# Altium project ecube.PrjPCB
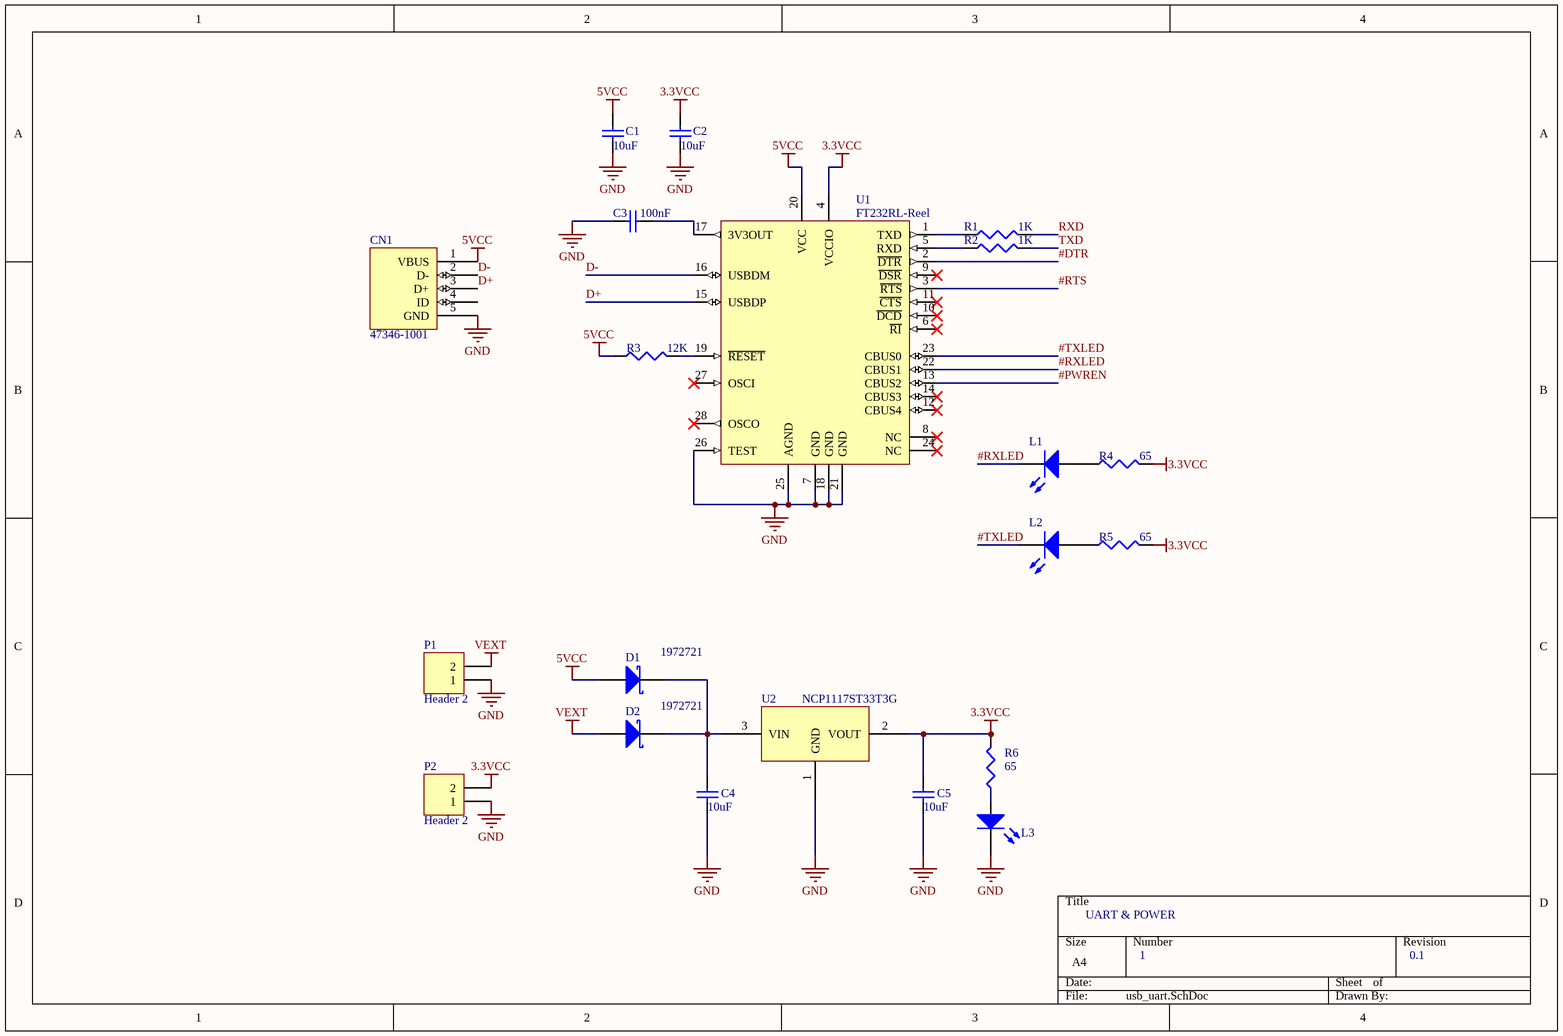
[diagram p0: usb_uart.SchDoc]
3 sheets, 56 parts. Net scope: global (net labels, ports and power ports of the same name join across sheets).
Board file: PCB1.PcbDoc
Sheets:
  usb_uart.SchDoc
  processingsys.SchDoc
  mpu6050.SchDoc

## Sheet usb_uart.SchDoc
size A4

### Parts
C1  value 10uF  [C1206]  (hidden comment: Cap Semi)
C2  value 10uF  [C1206]  (hidden comment: Cap Semi)
C3  value 100nF  [C1206]  (hidden comment: Cap Semi)
C4  value 10uF  [C1206]  (hidden comment: Cap Semi)
C5  value 10uF  [C1206]  (hidden comment: Cap Semi)
CN1  47346-1001  [47346-1001]
D1  Supplier Part Number 1: 1972721  [SOD-128]  (hidden comment: PMEG3020DEP,115)
D2  Supplier Part Number 1: 1972721  [SOD-128]  (hidden comment: PMEG3020DEP,115)
L1  KM-23  [SOT-23]  (value not drawn)
L2  KM-23  [SOT-23]  (value not drawn)
L3  KM-23  [SOT-23]  (value not drawn)
P1  Header 2  [HDR1X2]
P2  Header 2  [HDR1X2]
R1  value 1K  [J1-0603]  (hidden comment: Res3)
R2  value 1K  [J1-0603]  (hidden comment: Res3)
R3  value 12K  [J1-0603]  (hidden comment: Res3)
R4  value 65  [J1-0603]  (hidden comment: Res3)
R5  value 65  [J1-0603]  (hidden comment: Res3)
R6  value 65  [J1-0603]  (hidden comment: Res3)
U1  FT232RL-Reel  [SSOP-28_N]
U2  NCP1117ST33T3G  [SOT-223-3]

### Nets
3.3VCC: C2.2 C5.1 P2.2 R4.2 R5.2 R6.2 U1.4(VCCIO) U2.2(VOUT)
5VCC: C1.2 CN1.1(VBUS) D1.2(A) R3.1 U1.20(VCC)
GND: C1.1 C2.1 C3.1 C4.1 C5.2 CN1.5(GND) L3.3(K) P1.1 P2.1 U1.7(GND) U1.18(GND) U1.21(GND) U1.25(AGND) U1.26(TEST) U2.1(GND)
VEXT: D2.2(A) P1.2
#DTR: U1.2(~{DTR})
#PWREN: U1.13(CBUS2)
#RTS: U1.3(~{RTS})
#RXLED: L1.3(K) U1.22(CBUS1)
#TXLED: L2.3(K) U1.23(CBUS0)
D+: CN1.3(D+) U1.15(USBDP)
D-: CN1.2(D-) U1.16(USBDM)
RXD: R1.2
TXD: R2.2
NetC3_2: C3.2 U1.17(3V3OUT)
NetC4_2: C4.2 D1.1(K) D2.1(K) U2.3(VIN)
NetL1_1: L1.1(A) R4.1
NetL2_1: L2.1(A) R5.1
NetL3_1: L3.1(A) R6.1
NetR1_1: R1.1 U1.1(TXD)
NetR2_1: R2.1 U1.5(RXD)
NetR3_2: R3.2 U1.19(~{RESET})

Not connected (* = marked no-connect by the designer): CN1 4(ID); U1 6(~{RI})* 8(NC)* 9(~{DSR})* 10(~{DCD})* 11(~{CTS})* 12(CBUS4)* 14(CBUS3)* 24(NC)* 27(OSCI)* 28(OSCO)*

### Notes on the sheet
- UART & POWER
- 1
- 0.1

### Library data of the parts
C1-C5 = Cap Semi: Capacitor (Semiconductor SIM Model); Published: 8-Jun-2000; LatestRevisionDate: 29-May-2009; LatestRevisionNote: IPC-7351 Footprint Added.; PackageReference: C1206; Publisher: Altium Limited; PackageDescription: Chip Capacitor
CN1 = 47346-1001: MOLEX - 47346-1001 - MULTIPOLE CONNECTOR Conector USB, Micro USB Tipo B, USB 2.0 Montaje Superficial,; Number of Circuits: 5; Pitch: 0.65mm; ComponentLink1Description: Farnell; ComponentLink1URL: https://es.farnell.com/molex/47346-1001/conector-micro-usb-tipo-b-hembra/dp/2782045?st=Conector%20USB,%20Micro%20USB%20Tipo%20B; Supplier 1: Farnell; Manufacturer: Molex; Manufacturer Part Number: 47346-1001; Stock 1: 336; Pricing 1: 1=0.624, 60=0.6, 200=0.556, 500=0.532, 1000=0.503 (EUR); Mount: Surface Mount; Contact Material: Copper Alloy; Contact Plating: Gold; Housing Material: Polymer; Min Operating Temperature: -30°C; Max Operating Temperature: 85°C; Orientation: Right Angle; Termination: Solder; Length: 7.8mm; REACH SVHC: No SVHC; Halogen Free: Low Halogen
D1 D2 = PMEG3020DEP,115: NEXPERIA - Rectificador Schottky, 30 V, 2 A; Manufacturer: NXP Semiconductors; Forward Current: 2A; Max Repetitive Reverse Voltage (Vrrm): 30V; Element Configuration: Single; Forward Voltage: 520mV; Peak Reverse Current: 50uA; Peak Non-Repetitive Surge Current: 50A; Max Power Dissipation: 625mW; ComponentLink1Description: farnell; ComponentLink1URL: https://es.farnell.com/nexperia/pmeg3020dep-115/diodo-schott-rect-30v-2a-sod128/dp/1972721?st=PMEG3020DEP,115; Supplier 1: Farnell; Manufacturer Part Number: PMEG3020DEP,115; Stock 1: 4; Pricing 1: 5=0.351, 25=0.27, 100=0.189, 250=0.167, 500=0.145, 1000=0.123, 5000=0.106 (EUR); Mount: Surface Mount; Number of Pins: 2; Min Operating Temperature: -55°C; Max Operating Temperature: 150°C; Packaging: Tape and Reel; Max Surge Current: 50A; Package Quantity: 3000; Max Reverse Leakage Current: 50uA; Average Rectified Current: 2A; Max Reverse Voltage (DC): 30V; Radiation Hardening: No; Lead Free: Lead Free; ComponentLink2URL: http://www.nxp.com/documents/data_sheet/PMEG3020DEP.pdf?ecmp=mouser; ComponentLink2Description: http://www.nxp.com/documents/data_sheet/PMEG3020DEP.pdf?ecmp=mouser; ComponentLink3URL: http://www.nxp.com/documents/data_sheet/PMEG3020DEP.pdf; ComponentLink3Description: http://www.nxp.com/documents/data_sheet/PMEG3020DEP.pdf
L1-L3 = KM-23: Kingbright - LED, SOT-23; Manufacturer Part Number: KM-23ID-F; Colour: Red; Lens Colour: Clear; Viewing Angle: 140°; Forward Voltage: 2V; Lens Style: Colored,Diffused,Rectangular; Luminous Intensity: 12mcd; Wavelength: 625nm; Forward Current: 20mA; Number of LEDs: 1; ComponentLink1Description: farnell -RED; ComponentLink1URL: https://es.farnell.com/kingbright/km-23id-f/led-red-sot-23-smd/dp/2099216?st=KM-23ID; ComponentLink2Description: farnell-Green; ComponentLink2URL: https://es.farnell.com/kingbright/km-23sgd-f/led-green-sot-23-smd/dp/2099217?st=KM-23; Supplier 1: Farnell; Manufacturer: Kingbright; Stock 1: 10839; Pricing 1: 5=0.118, 25=0.112, 100=0.106, 250=0.101, 500=0.0968, 1000=0.0928 (GBP); Mount: Surface Mount; Case/Package: SOT-23; Number of Pins: 3; Dominant Wavelength: 625nm; Length: 2.8mm; Height: 1mm; Width: 1.2mm; Radiation Hardening: No; REACH SVHC: No SVHC; ComponentLink3URL: http://www.farnell.com/datasheets/1563685.pdf; ComponentLink3Description: http://www.farnell.com/datasheets/1563685.pdf; ComponentLink4URL: https://www.distrelec.biz/Web/Downloads/d_/en/cuKingbright_SOT-23_SMT-LED_EN.pdf?mime=application%2Fpdf; ComponentLink4Description: https://www.distrelec.biz/Web/Downloads/d_/en/cuKingbright_SOT-23_SMT-LED_EN.pdf?mime=application%2Fpdf; ComponentLink5URL: http://uk.rs-online.com/webdocs/032f/0900766b8032f166.pdf; ComponentLink5Description: http://uk.rs-online.com/webdocs/032f/0900766b8032f166.pdf; ComponentLink6URL: http://www.produktinfo.conrad.com/datenblaetter/175000-199999/180090-da-01-en-LED_SOT23_TYP_KM_23ID_F.pdf; ComponentLink6Description: http://www.produktinfo.conrad.com/datenblaetter/175000-199999/180090-da-01-en-LED_SOT23_TYP_KM_23ID_F.pdf; ComponentLink7URL: http://www.produktinfo.conrad.com/datenblaetter/125000-149999/144223-da-01-en-SMD_Leuchtdioden_KM23ID_Sot23_rot.pdf; ComponentLink7Description: http://www.produktinfo.conrad.com/datenblaetter/125000-149999/144223-da-01-en-SMD_Leuchtdioden_KM23ID_Sot23_rot.pdf
P1 P2 = Header 2: Header, 2-Pin; LatestRevisionDate: 17-Jul-2002; LatestRevisionNote: Re-released for DXP Platform.; Publisher: Altium Limited
R1-R6 = Res3: Resistor; Published: 8-Jun-2000; LatestRevisionDate: 29-May-2009; LatestRevisionNote: IPC-7351 Footprint Added.; PackageReference: J1-0603; Publisher: Altium Limited; PackageDescription: Chip Resistor
U1 = FT232RL-Reel: USB UART Asynchronous Serial Data Transfer Chip, SSOP-28, Tape and Reel; Published: 19-Aug-2010; DatasheetVersion: ver 2.07, Jul-2010; PackageVersion: 2010; PackageReference: SSOP-28; Publisher: Altium Limited; PackageDescription: 28-Pin Small Outline Package 0.65 mm Pitch; ComponentLink1Description: Manufacturer Link; ComponentLink1URL: http://www.ftdichip.com/Products/ICs/FT232R.htm; ComponentLink2Description: Datasheet; ComponentLink2URL: http://www.ftdichip.com/Support/Documents/DataSheets/ICs/DS_FT232R.pdf
U2 = NCP1117ST33T3G: ON SEMICONDUCTOR  - Regulador de Tensión Fija LDO 3.3V 1A; Max Input Voltage: 20V; Number of Outputs: 1; Dropout Voltage: 1.07V; Max Supply Voltage: 15V; Min Supply Voltage: 4.75V; Min Input Voltage: 3.5V; Input Bias Current: 6mA; Quiescent Current: 10mA; Polarity: Positive; Reference Voltage: 1.25V; Accuracy: 1%; Output Type: Fixed; ComponentLink1Description: farnell; ComponentLink1URL: https://es.farnell.com/on-semiconductor/ncp1117st33t3g/ic-linear-voltage-regulator/dp/1652366?st=NCP1117ST33T3G; Supplier 1: Farnell; Manufacturer: ON Semiconductor; Manufacturer Part Number: NCP1117ST33T3G; Stock 1: 0; Pricing 1: 150=0.196, 250=0.174, 500=0.151, 1000=0.129, 5000=0.121, 10000=0.116 (EUR); Mount: Surface Mount; Case/Package: SOT-223; Number of Pins: 3; Contact Plating: Matte,Tin; Min Operating Temperature: 0°C; Max Operating Temperature: 125°C; Output Voltage: 3.3V; Packaging: Tape and Reel; Output Current: 1A; Max Output Current: 1A; Package Quantity: 1; Nominal Output Voltage: 3.3V; Number of Regulators: 1; Min Current Limit: 1A; Min Output Voltage: 3.3V; Max Output Voltage: 3.3V; Termination: SMD/SMT; Output Voltage Accuracy: 1%; Length: 6.7mm; Height: 1.69mm; Width: 3.7mm; Radiation Hardening: No; REACH SVHC: No SVHC; Lead Free: Lead Free; Halogen Free: Halogen Free; ComponentLink2URL: http://www.onsemi.ru.com/pub/Collateral/NCP1117-D.PDF; ComponentLink2Description: http://www.onsemi.ru.com/pub/Collateral/NCP1117-D.PDF; ComponentLink3URL: http://www.farnell.com/datasheets/1726422.pdf; ComponentLink3Description: http://www.farnell.com/datasheets/1726422.pdf; ComponentLink4URL: http://www.onsemi.com/pub/Collateral/NCP1117-D.PDF; ComponentLink4Description: http://www.onsemi.com/pub/Collateral/NCP1117-D.PDF; ComponentLink5URL: https://www.verical.com/server-webapp/html/getDatasheet?partID=82718; ComponentLink5Description: https://www.verical.com/server-webapp/html/getDatasheet?partID=82718; ComponentLink6URL: http://www.farnell.com/datasheets/1748260.pdf; ComponentLink6Description: http://www.farnell.com/datasheets/1748260.pdf; ComponentLink7URL: http://www.onsemi.com/pub_link/Collateral/NCP1117-D.PDF; ComponentLink7Description: http://www.onsemi.com/pub_link/Collateral/NCP1117-D.PDF

## Sheet processingsys.SchDoc
size A4
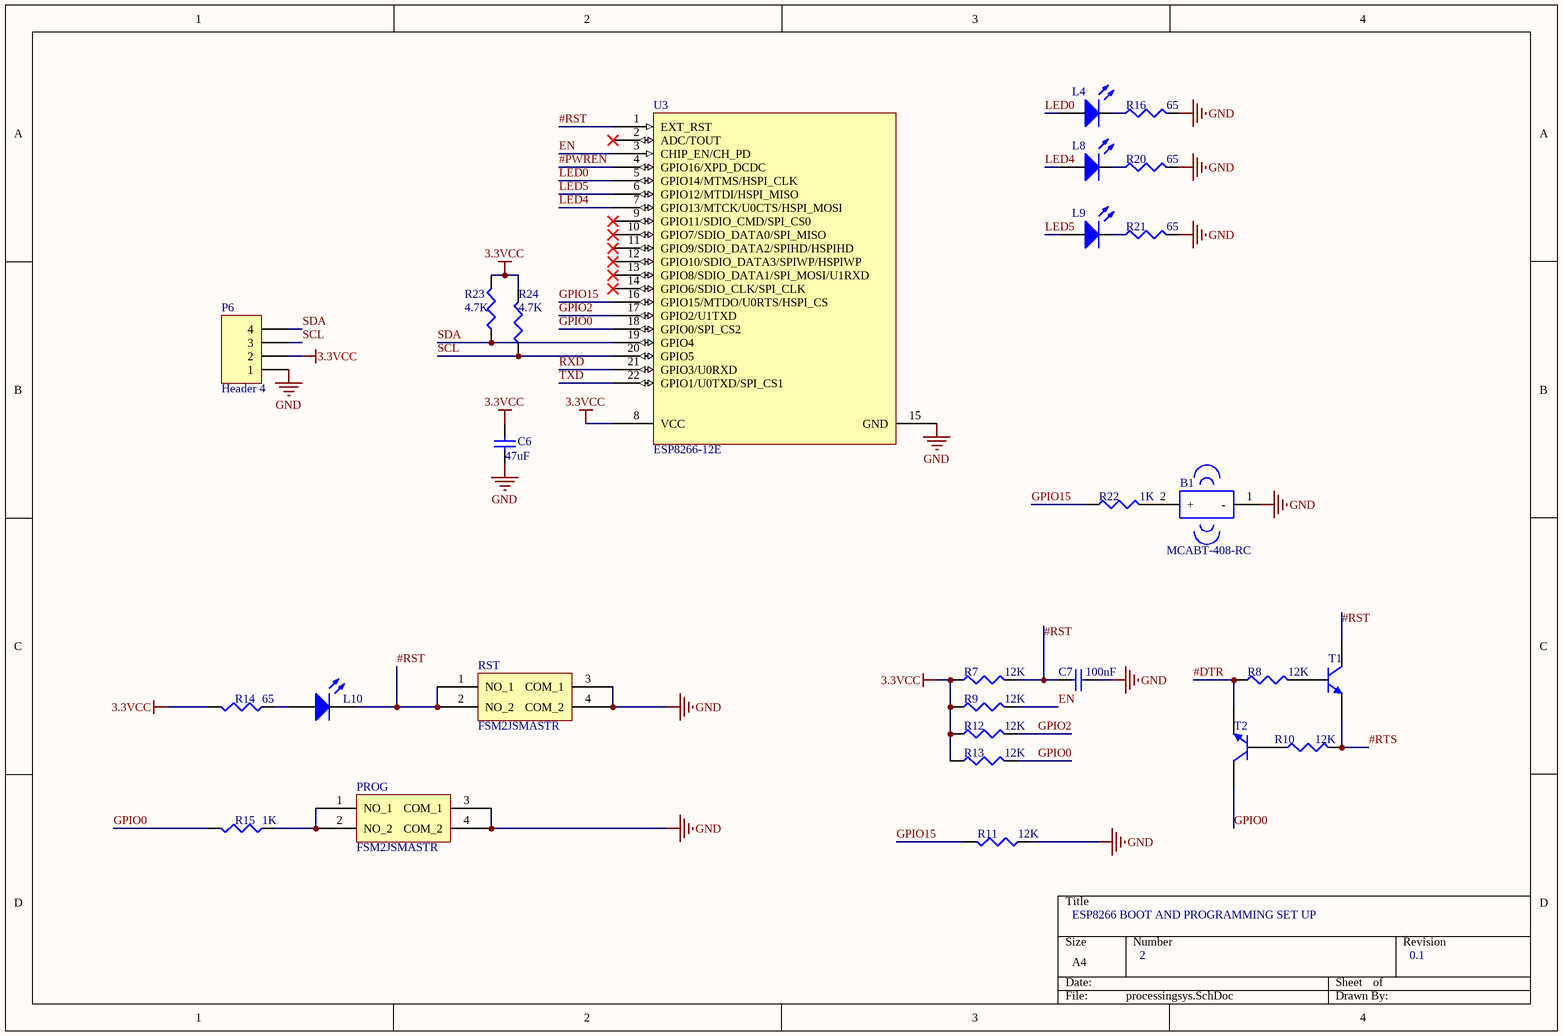
[diagram p1: processingsys.SchDoc]

### Parts
B1  MCABT-408-RC  [MCABT-408-RC]
C6  value 47uF  [C1206]  (hidden comment: Cap Semi)
C7  value 100nF  [C1206]  (hidden comment: Cap Semi)
L4  KM-23  [SOT-23]  (value not drawn)
L8  KM-23  [SOT-23]  (value not drawn)
L9  KM-23  [SOT-23]  (value not drawn)
L10  KM-23  [SOT-23]  (value not drawn)
P6  Header 4  [HDR1X4]
PROG  FSM2JSMASTR  [BUTTON_SMD]
R7  value 12K  [J1-0603]  (hidden comment: Res3)
R8  value 12K  [J1-0603]  (hidden comment: Res3)
R9  value 12K  [J1-0603]  (hidden comment: Res3)
R10  value 12K  [J1-0603]  (hidden comment: Res3)
R11  value 12K  [J1-0603]  (hidden comment: Res3)
R12  value 12K  [J1-0603]  (hidden comment: Res3)
R13  value 12K  [J1-0603]  (hidden comment: Res3)
R14  value 65  [J1-0603]  (hidden comment: Res3)
R15  value 1K  [J1-0603]  (hidden comment: Res3)
R16  value 65  [J1-0603]  (hidden comment: Res3)
R20  value 65  [J1-0603]  (hidden comment: Res3)
R21  value 65  [J1-0603]  (hidden comment: Res3)
R22  value 1K  [J1-0603]  (hidden comment: Res3)
R23  value 4.7K  [J1-0603]  (hidden comment: Res3)
R24  value 4.7K  [J1-0603]  (hidden comment: Res3)
RST  FSM2JSMASTR  [BUTTON_SMD]
T1  SBC846BWT1G  [SOT-323]  (value not drawn)
T2  SBC846BWT1G  [SOT-323]  (value not drawn)
U3  ESP8266-12E  [ESP8266-12E]

### Nets
3.3VCC: C6.2 P6.2 R7.1 R9.1 R12.1 R13.1 R14.2 R23.2 R24.2 U3.8(VCC)
GND: B1.1(-) C6.1 C7.1 P6.1 PROG.3(COM_1) PROG.4(COM_2) R11.1 R16.2 R20.2 R21.2 RST.3(COM_1) RST.4(COM_2) U3.15(GND)
#DTR: R8.1 T2.2(E)
#PWREN: U3.4(GPIO16/XPD_DCDC)
#RST: C7.2 L10.3(K) R7.2 RST.1(NO_1) RST.2(NO_2) T1.3(C) U3.1(EXT_RST)
#RTS: R10.2 T1.2(E)
EN: R9.2 U3.3(CHIP_EN/CH_PD)
GPIO0: R13.2 R15.2 T2.3(C) U3.18(GPIO0/SPI_CS2)
GPIO2: R12.2 U3.17(GPIO2/U1TXD)
GPIO15: R11.2 R22.1 U3.16(GPIO15/MTDO/U0RTS/HSPI_CS)
LED0: L4.1(A) U3.5(GPIO14/MTMS/HSPI_CLK)
LED4: L8.1(A) U3.7(GPIO13/MTCK/U0CTS/HSPI_MOSI)
LED5: L9.1(A) U3.6(GPIO12/MTDI/HSPI_MISO)
RXD: U3.21(GPIO3/U0RXD)
SCL: P6.3 R24.1 U3.20(GPIO5)
SDA: P6.4 R23.1 U3.19(GPIO4)
TXD: U3.22(GPIO1/U0TXD/SPI_CS1)
NetB1_2: B1.2(+) R22.2
NetL4_3: L4.3(K) R16.1
NetL8_3: L8.3(K) R20.1
NetL9_3: L9.3(K) R21.1
NetL10_1: L10.1(A) R14.1
NetPROG_1: PROG.1(NO_1) PROG.2(NO_2) R15.1
NetR8_2: R8.2 T1.1(B)
NetR10_1: R10.1 T2.1(B)

Not connected (* = marked no-connect by the designer): U3 2(ADC/TOUT)* 9(GPIO11/SDIO_CMD/SPI_CS0)* 10(GPIO7/SDIO_DATA0/SPI_MISO)* 11(GPIO9/SDIO_DATA2/SPIHD/HSPIHD)* 12(GPIO10/SDIO_DATA3/SPIWP/HSPIWP)* 13(GPIO8/SDIO_DATA1/SPI_MOSI/U1RXD)* 14(GPIO6/SDIO_CLK/SPI_CLK)*

### Notes on the sheet
- ESP8266 BOOT AND PROGRAMMING SET UP
- 2
- 0.1

### Library data of the parts
B1 = MCABT-408-RC: ransductor, 1 V a 3 V, 85 dBA, Sirena, 70 mA; Manufacturer: Multicomp; Current Rating: 70mA; Self Resonant Frequency: 2.731kHz; Min Supply Voltage: 1V; Max Supply Voltage: 3V; Outside Diameter: 12mm; ComponentLink1Description: farnell; ComponentLink1URL: https://es.farnell.com/multicomp/mcabt-408-rc/ac-stico-electro-mech-audio-1/dp/2361105?krypto=Kzr7701dNdWkobLwazw2WAHmNHziskZrQMg7S%2Faf%2BaL%2F%2Bj%2FkWh1M3S1k%2FYSHSKSx0MzERa16wH8IxUPYeDKx2PmCEW9b7Qq2dWm4YJR83SHnond9nZgPFyrqEJusaoJIK60fC%2FoQdI36P39N2BQPzNsuueVDbqXwGAOKtHeDF30EVb%2FMeWA5wOoM2bNdaZFSgNjAKDp4mZigEnbiecpx7MGL6JOzzhP9BWUiYbys6ks5dt9LMNmTnpFtdjo7H2akCj%2F%2BfLNG71ArvMaoxZ0WMv4hKuovOAWfA3NHFC9HmqzoIwqKqKgSbKZowJ%2Btqn8YlCHLgv9T7vbfNqK3ZjJzUnVd%2FT%2BsNsbTS0FSkhssYu9EDD5ZGkWROWS0H93J6TpgHhXKvnZj%2BSUvRf0Y%2Bf3ZsPXOKqdIdoKAc%2FpA98XWUfDfcYNhjP%2Fdf3fuxTewHmiKE8rVjXfHvkQUwmS1KThmixSSWsU6BPdfoeHtQ48EBKM%3D&ddkey=https%3Aes-ES%2FElement14_Spain%2Fsearch; Supplier 1: Farnell; Manufacturer Part Number: MCABT-408-RC; Stock 1: 1057; Pricing 1: 1=0.967, 5=0.876, 10=0.795, 20=0.738, 40=0.723, 100=0.708, 500=0.694 (EUR); Height: 7.5mm; REACH SVHC: Unknown; ComponentLink2URL: http://www.farnell.com/datasheets/1768519.pdf; ComponentLink2Description: http://www.farnell.com/datasheets/1768519.pdf
C6 C7 = Cap Semi: Capacitor (Semiconductor SIM Model); Published: 8-Jun-2000; LatestRevisionDate: 29-May-2009; LatestRevisionNote: IPC-7351 Footprint Added.; PackageReference: C1206; Publisher: Altium Limited; PackageDescription: Chip Capacitor
L4 L8-L10 = KM-23: as L1 on sheet usb_uart; ComponentLink1Description: farnell -RED; ComponentLink1URL: https://es.farnell.com/kingbright/km-23id-f/led-red-sot-23-smd/dp/2099216?st=KM-23ID; ComponentLink2Description: farnell-Green; ComponentLink2URL: https://es.farnell.com/kingbright/km-23sgd-f/led-green-sot-23-smd/dp/2099217?st=KM-23; Supplier 1: Farnell; Manufacturer: Kingbright; Stock 1: 10839; Pricing 1: 5=0.118, 25=0.112, 100=0.106, 250=0.101, 500=0.0968, 1000=0.0928 (GBP); Mount: Surface Mount; Case/Package: SOT-23; Number of Pins: 3; Dominant Wavelength: 625nm; Length: 2.8mm; Height: 1mm; Width: 1.2mm; Radiation Hardening: No; REACH SVHC: No SVHC; ComponentLink3URL: http://www.farnell.com/datasheets/1563685.pdf; ComponentLink3Description: http://www.farnell.com/datasheets/1563685.pdf; ComponentLink4URL: https://www.distrelec.biz/Web/Downloads/d_/en/cuKingbright_SOT-23_SMT-LED_EN.pdf?mime=application%2Fpdf; ComponentLink4Description: https://www.distrelec.biz/Web/Downloads/d_/en/cuKingbright_SOT-23_SMT-LED_EN.pdf?mime=application%2Fpdf; ComponentLink5URL: http://uk.rs-online.com/webdocs/032f/0900766b8032f166.pdf; ComponentLink5Description: http://uk.rs-online.com/webdocs/032f/0900766b8032f166.pdf; ComponentLink6URL: http://www.produktinfo.conrad.com/datenblaetter/175000-199999/180090-da-01-en-LED_SOT23_TYP_KM_23ID_F.pdf; ComponentLink6Description: http://www.produktinfo.conrad.com/datenblaetter/175000-199999/180090-da-01-en-LED_SOT23_TYP_KM_23ID_F.pdf; ComponentLink7URL: http://www.produktinfo.conrad.com/datenblaetter/125000-149999/144223-da-01-en-SMD_Leuchtdioden_KM23ID_Sot23_rot.pdf; ComponentLink7Description: http://www.produktinfo.conrad.com/datenblaetter/125000-149999/144223-da-01-en-SMD_Leuchtdioden_KM23ID_Sot23_rot.pdf
P6 = Header 4: Header, 4-Pin; LatestRevisionDate: 17-Jul-2002; LatestRevisionNote: Re-released for DXP Platform.; Publisher: Altium Limited
PROG RST = FSM2JSMASTR: TE Connectivity - Interruptor Táctil, Montaje Superficial (SMD); Manufacturer Part Number: 1977223-4; Mechanical Life: 1000000Cycles; Actuator Material: Nylon; Throw Configuration: SPST; Voltage Rating (DC): 24V; Operating Force: 1.57N; Max Current Rating: 50mA; Actuator Length: 0.7mm; ComponentLink1Description: farnell; ComponentLink1URL: https://es.farnell.com/alcoswitch-te-connectivity/fsm2jsmastr/interruptor-t-ctil-spst-0-05a/dp/2610941?krypto=STQKwvVYAPccPvWo2qKFm%2B2gHuVF7WkaqIiu7Dm0cJ5iCIeV7DHhPViRfCOgoFsJStXtod%2BnIQ%2BYkMVEvW6iM3AuzhepTn6uOw1UVwc7VB8KUrNLl0uQiR%2Bt35da8c9%2BQU171xU6PFtEc8EnsSVD6zTrAoZNeFTntAPThe1lSw75SwgbO5cQ33JndyglwNSD%2Fmpse8Gtvc2qmuIyzAgV9svHZkncDZZX6ZXbcKP216NPBEjbrtNYbKi2SeLDw4XeR8vtbf5NJKVxMUwbBhIrG2GTfYXybkb4t0M%2BFUX2Mjpm2Pqiy7%2FaHyLXsF%2F6JqWeJ%2FtTnNjkvf4o7u918wSV9RxDYtXvBiLcNJGrHbUuu6%2BAwcACzT8Mk6xWTk1NrmLNmfrigBPTmYlqdrRkSyqTCN5s9fVyopuyy4jhDrGN6PxrQet12eg7oAfq92u%2FGproWwHxsaTab23LGvFEnuMkIb5ATL7w%2Fr2VOeHmcwkXp7E%3D&ddkey=https%3Aes-ES%2FElement14_Spain%2Fsearch; Supplier 1: Farnell; Manufacturer: TE Connectivity; Stock 1: 1514; Pricing 1: 5=0.184, 100=0.179, 250=0.173, 1000=0.168, 2500=0.162 (EUR); Mount: Surface Mount; Case/Package: SMD/SMT; Contact Material: Copper Alloy; Contact Plating: Silver; Min Operating Temperature: -40°C; Max Operating Temperature: 105°C; Packaging: Tape and Reel; Termination: Gull Wing; Max Voltage Rating (DC): 24V; Orientation: Straight; Contact Current Rating: 50mA; Type: Switch; Length: 6mm; Depth: 10mm; Radiation Hardening: No; ELV: Compliant; ComponentLink2URL: http://www.te.com/commerce/DocumentDelivery/DDEController?Action=srchrtrv&DocNm=1308111-1_SWITCHES_CORE_PROGRAM_CATALOG&DocType=Catalog+Section&DocLang=English; ComponentLink2Description: http://www.te.com/commerce/DocumentDelivery/DDEController?Action=srchrtrv&DocNm=1308111-1_SWITCHES_CORE_PROGRAM_CATALOG&DocType=Catalog+Section&DocLang=English
R7-R16 R20-R24 = Res3: Resistor; Published: 8-Jun-2000; LatestRevisionDate: 29-May-2009; LatestRevisionNote: IPC-7351 Footprint Added.; PackageReference: J1-0603; Publisher: Altium Limited; PackageDescription: Chip Resistor
T1 T2 = SBC846BWT1G: ON SEMICONDUCTOR - SBC846BWT1G - TRANSISTOR, BIPOL, NPN, 65V; Max Power Dissipation: 150mW; Frequency: 100MHz; Collector Base Voltage (VCBO): 80V; Emitter Base Voltage (VEBO): 6V; Collector Emitter Saturation Voltage: 600mV; Max Collector Current: 100mA; Number of Elements: 1; Element Configuration: Single; ComponentLink1Description: farnell; ComponentLink1URL: https://es.farnell.com/on-semiconductor/sbc846bwt1g/transistor-bipolar-npn-65-v/dp/2533346?st=SBC846BWT1G; Supplier 1: Farnell; Manufacturer: ON Semiconductor; Manufacturer Part Number: SBC846BWT1G; Stock 1: 0; Pricing 1: 150=0.0932, 250=0.0803, 500=0.0675, 1000=0.0545, 5000=0.0456 (EUR); Case/Package: SC; Number of Pins: 3; Min Operating Temperature: -55°C; Max Operating Temperature: 150°C; Package Quantity: 3000; Packaging: Tape and Reel; Collector Emitter Voltage (VCEO): 65V; Polarity: NPN; Collector Emitter Breakdown Voltage: 65V; Transition Frequency: 100MHz; Max Breakdown Voltage: 65V; Power Dissipation: 150mW; Gain Bandwidth Product: 100MHz; Radiation Hardening: No; REACH SVHC: No SVHC; Lead Free: Lead Free; Halogen Free: Halogen Free; ComponentLink2URL: http://www.mouser.com/ds/2/308/BC846AWT1-D-103558.pdf; ComponentLink2Description: http://www.mouser.com/ds/2/308/BC846AWT1-D-103558.pdf; ComponentLink3URL: http://www.onsemi.com/pub/Collateral/BC846AWT1-D.PDF; ComponentLink3Description: http://www.onsemi.com/pub/Collateral/BC846AWT1-D.PDF
U3 = ESP8266-12E: Manufacturer: Adafruit Industries; Manufacturer Part Number: 2491; Frequency: 2.4GHz; Data Rate: 72.2Mbps; Sensitivity: -91dBm; Interface: I2C,SPI,UART; Current - Receiving: 56mA; Current - Transmitting: 170mA; Supplier 1: Mouser; Stock 1: 0; Mount: Surface Mount; Case/Package: Module; Min Operating Temperature: -40°C; Max Operating Temperature: 125°C; Packaging: Bulk

## Sheet mpu6050.SchDoc
size A4
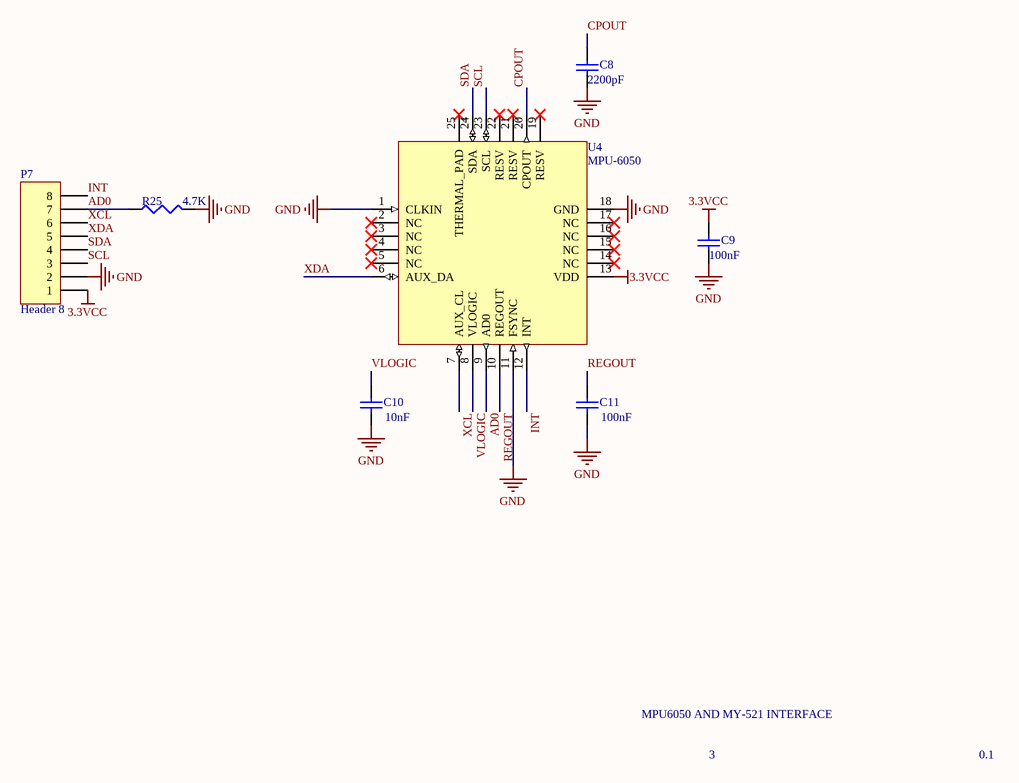
[diagram p2: mpu6050.SchDoc]

### Parts
C8  value 2200pF  [C1206]  (hidden comment: Cap Semi)
C9  value 100nF  [C1206]  (hidden comment: Cap Semi)
C10  value 10nF  [C1206]  (hidden comment: Cap Semi)
C11  value 100nF  [C1206]  (hidden comment: Cap Semi)
P7  Header 8  [HDR1X8]
R25  value 4.7K  [J1-0603]  (hidden comment: Res3)
U4  MPU-6050  [QFN50P400X400X95-25N]

### Nets
3.3VCC: C9.2 P7.1 U4.13(VDD)
GND: C8.1 C9.1 C10.1 C11.1 P7.2 R25.2 U4.1(CLKIN) U4.11(FSYNC) U4.18(GND)
AD0: P7.7 R25.1 U4.9(AD0)
CPOUT: C8.2 U4.20(CPOUT)
INT: P7.8 U4.12(INT)
REGOUT: C11.2 U4.10(REGOUT)
SCL: P7.3 U4.23(SCL)
SDA: P7.4 U4.24(SDA)
VLOGIC: C10.2 U4.8(VLOGIC)
XCL: P7.6 U4.7(AUX_CL)
XDA: P7.5 U4.6(AUX_DA)

Not connected (* = marked no-connect by the designer): U4 2(NC)* 3(NC)* 4(NC)* 5(NC)* 14(NC)* 15(NC)* 16(NC)* 17(NC)* 19(RESV)* 21(RESV)* 22(RESV)* 25(THERMAL_PAD)*

### Notes on the sheet
- MPU6050 AND MY-521 INTERFACE
- 3
- 0.1

### Library data of the parts
C8-C11 = Cap Semi: Capacitor (Semiconductor SIM Model); Published: 8-Jun-2000; LatestRevisionDate: 29-May-2009; LatestRevisionNote: IPC-7351 Footprint Added.; PackageReference: C1206; Publisher: Altium Limited; PackageDescription: Chip Capacitor
P7 = Header 8: Header, 8-Pin; LatestRevisionDate: 17-Jul-2002; LatestRevisionNote: Re-released for DXP Platform.; Publisher: Altium Limited
R25 = Res3: Resistor; Published: 8-Jun-2000; LatestRevisionDate: 29-May-2009; LatestRevisionNote: IPC-7351 Footprint Added.; PackageReference: J1-0603; Publisher: Altium Limited; PackageDescription: Chip Resistor
U4 = MPU-6050: INVENSENSE - Módulo MEMS, Giroscopio de Tres Ejes, Acelerómetro de Tres Ejes; Manufacturer: TDK InvenSense; Interface: I2C; Min Supply Voltage: 2.5V; Max Supply Voltage: 3.6V; Output Type: Digital; Sensitivity: 16384LSB/g; ComponentLink1Description: farnell; ComponentLink1URL: https://es.farnell.com/invensense/mpu-6050/giroscop-aceler-m-6-ejes-i2c-qfn/dp/1864742?st=MPU-6050; Supplier 1: Farnell; Manufacturer Part Number: MPU-6050; Stock 1: 0; Mount: Surface Mount; Case/Package: QFN; Number of Pins: 24; Min Operating Temperature: -40°C; Max Operating Temperature: 85°C; Package Quantity: 5000; Packaging: Cut Tape; Length: 4.1mm; Height: 0.9mm; Width: 4.1mm; REACH SVHC: No SVHC; ComponentLink2URL: http://www.farnell.com/datasheets/1788002.pdf; ComponentLink2Description: http://www.farnell.com/datasheets/1788002.pdf

## Nets that join several sheets
3.3VCC: usb_uart (8 pins), processingsys (10 pins), mpu6050 (C9.2 P7.1 U4.13)
GND: usb_uart (15 pins), processingsys (13 pins), mpu6050 (9 pins)
#DTR: usb_uart (U1.2), processingsys (R8.1 T2.2)
#PWREN: usb_uart (U1.13), processingsys (U3.4)
#RTS: usb_uart (U1.3), processingsys (R10.2 T1.2)
RXD: usb_uart (R1.2), processingsys (U3.21)
SCL: processingsys (P6.3 R24.1 U3.20), mpu6050 (P7.3 U4.23)
SDA: processingsys (P6.4 R23.1 U3.19), mpu6050 (P7.4 U4.24)
TXD: usb_uart (R2.2), processingsys (U3.22)